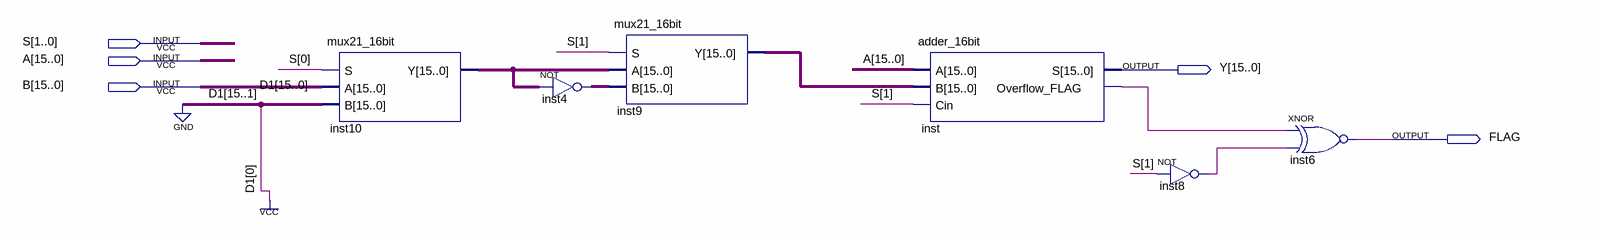
[diagram p0: schematic sheet]
// Quartus schematic AU.bdf as structural Verilog: 6 symbols, 5 pins
module AU (
  input  [1:0] S,
  input  [15:0] A,
  input  [15:0] B,
  output [15:0] Y,
  output FLAG
);

  wire inst8_out, inst_overflow_flag;
  wire [15:0] inst4_out, inst9_y, inst10_y;

  mux21_16bit inst10 (.S(S[0]), .A(B), .B(16'b0000000000000001), .Y(inst10_y));
  assign inst4_out = ~inst10_y;  // NOT inst4, 16 bits wide
  mux21_16bit inst9 (.S(S[1]), .A(inst10_y), .B(inst4_out), .Y(inst9_y));
  adder_16bit inst (.A(A), .B(inst9_y), .Cin(S[1]), .S(Y), .Overflow_FLAG(inst_overflow_flag));
  not inst8 (inst8_out, S[1]);
  xnor inst6 (FLAG, inst_overflow_flag, inst8_out);
endmodule
